# EAGLE board cigpack-main rc1a (EAGLE 4.13)
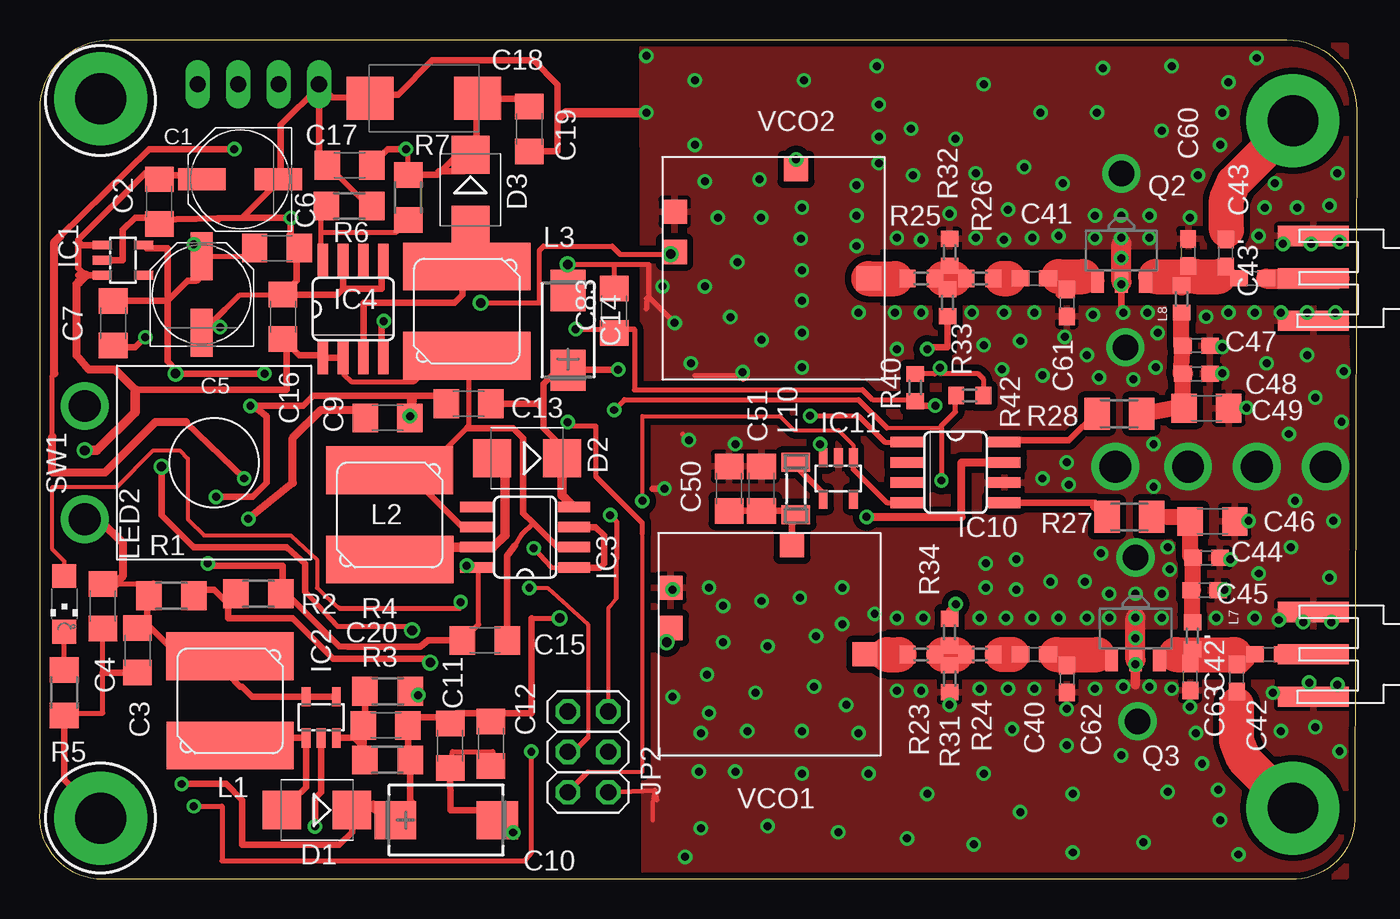
[diagram p1: board, top side]
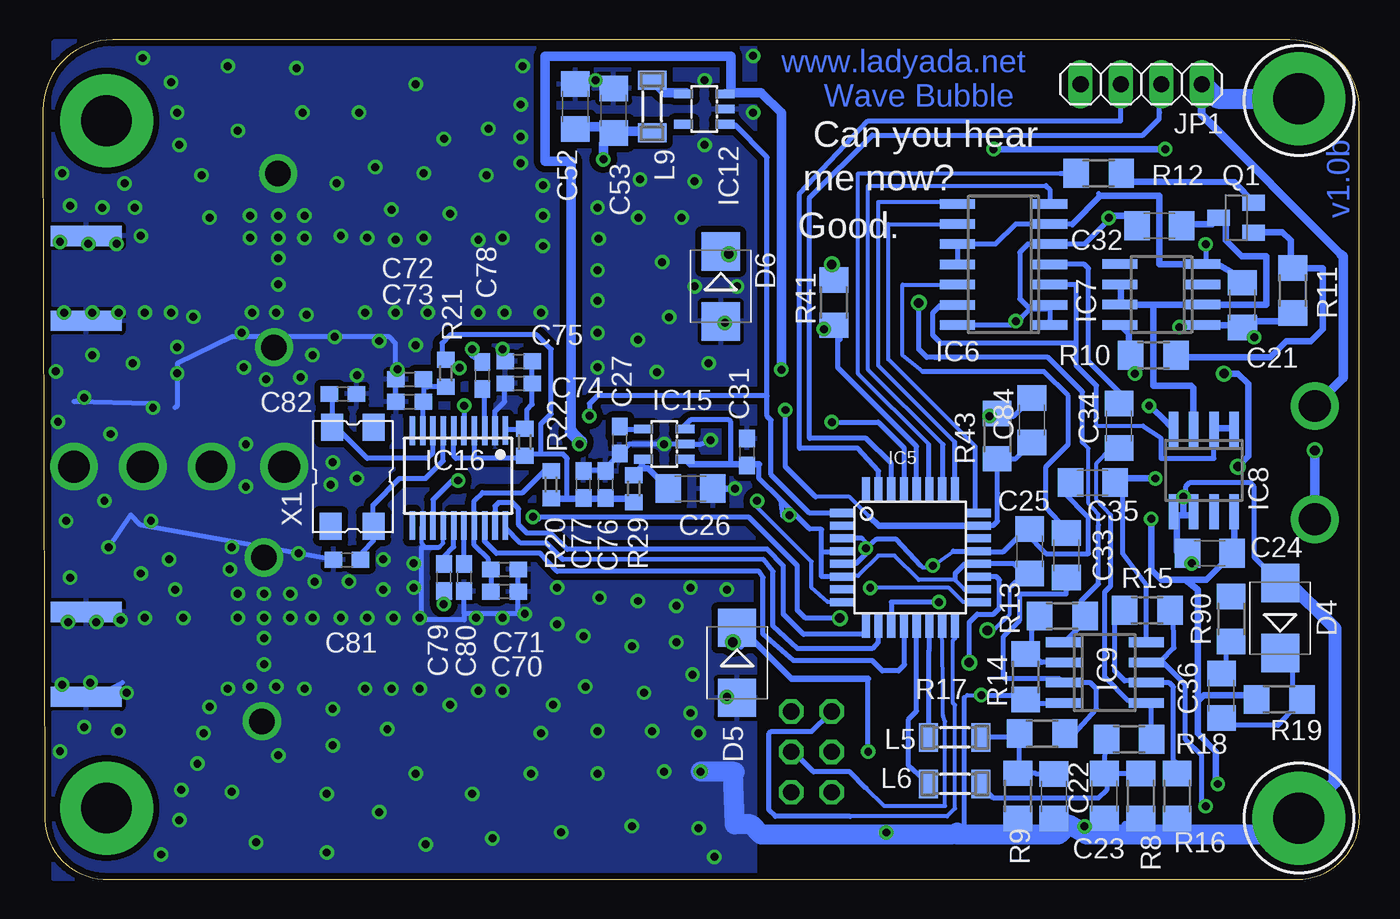
[diagram p2: board, bottom side, seen from below]

Size 82.75 x 52.73 mm. Coordinates in mm from the lower left corner, seen from the top.
Outline: 3.57,0 arc-90 0.02,4.31 0.02,48.34 arc-90 4.4,52.73 78.36,52.73 arc-90 82.75,48.32 82.65,4.08 arc-90 78.96,0 3.57,0
Copper layers (1*16): Top 0.035mm / dielectric 1.5mm / Bottom 0.035mm
Design rules "default": minimum track width 10mil, minimum drill 19mil, track to track 10mil, track to pad 10mil, pad to pad 10mil, via to via 10mil, smd to smd 0mil, copper to edge 10mil, drill to drill 8mil, minimum pad ring 10mil, minimum via ring 8mil, stop-mask expansion 4mil, vias tented up to drill 0mil, thermal gap 10mil

## Footprints (pad centres in the part's own frame; a part is rotated, then mirrored left to right if it is on the bottom)
PANASONIC_D = smd 3 x 1.4: + 2.4,0; - -2.4,0
C1206 = smd 1.6 x 1.8: 1 -1.4,0; 2 1.4,0
CT7343 = smd 2.6 x 2.4: + 3.2,0; - -3.2,0
CT6032 = smd 2.6 x 2.2: + 2.5,0; - -2.5,0
D/7343-31W = smd 2.95 x 2.7: + 3.375,0; - -3.375,0
C0603 = smd 1.1 x 1: 1 -0.85,0; 2 0.85,0
SMB = smd 2.4 x 2.4: A 2.2,0; C -2.2,0
SOT23-5L = smd 0.55 x 1.2: 1 -0.95,-1.3; 2 0,-1.3; 3 0.95,-1.3; 4 0.95,1.3; 5 -0.95,1.3
SO08 = smd 0.66 x 2.032: 1 -1.905,-3.073; 2 -0.635,-3.073; 3 0.635,-3.073; 4 1.905,-3.073; 5 1.905,3.073; 6 0.635,3.073; 7 -0.635,3.073; 8 -1.905,3.073
TQFP32-08 = smd 1.524 x 0.508: 1 -4.293,2.8; 2 -4.293,2; 3 -4.293,1.2; 4 -4.293,0.4; 5 -4.293,-0.4; 6 -4.293,-1.2; 7 -4.293,-2; 8 -4.293,-2.8; 17 4.293,-2.8; 18 4.293,-2; 19 4.293,-1.2; 20 4.293,-0.4; 21 4.293,0.4; 22 4.293,1.2; 23 4.293,2; 24 4.293,2.8 | smd 0.508 x 1.524: 9 -2.8,-4.293; 10 -2,-4.293; 11 -1.2,-4.293; 12 -0.4,-4.293; 13 0.4,-4.293; 14 1.2,-4.293; 15 2,-4.293; 16 2.8,-4.293; 25 2.8,4.293; 26 2,4.293; 27 1.2,4.293; 28 0.4,4.293; 29 -0.4,4.293; 30 -1.2,4.293; 31 -2,4.293; 32 -2.8,4.293
SO14 = smd 0.6 x 2.2: 1 -3.81,-2.9; 2 -2.54,-2.9; 3 -1.27,-2.9; 4 0,-2.9; 5 1.27,-2.9; 6 2.54,-2.9; 7 3.81,-2.9; 8 3.81,2.9; 9 2.54,2.9; 10 1.27,2.9; 11 0,2.9; 12 -1.27,2.9; 13 -2.54,2.9; 14 -3.81,2.9
SO08' = smd 0.6 x 2.2: 1 -1.905,-2.6; 2 -0.635,-2.6; 3 0.635,-2.6; 4 1.905,-2.6; 5 1.905,2.6; 6 0.635,2.6; 7 -0.635,2.6; 8 -1.905,2.6
TSSOP-20 = smd 0.35 x 1.8: 1 -2.835,-3.023; 2 -2.195,-2.999; 3 -1.545,-2.999; 4 -0.895,-2.999; 5 -0.245,-2.999; 6 0.405,-2.999; 7 1.055,-2.999; 8 1.705,-2.999; 9 2.355,-2.999; 10 3.005,-2.999; 11 3.005,2.951; 12 2.355,2.951; 13 1.705,2.951; 14 1.055,2.951; 15 0.405,2.951; 16 -0.245,2.951; 17 -0.895,2.951; 18 -1.545,2.951; 19 -2.195,2.951; 20 -2.845,2.951
1X04 = drill 1.016 long: 1 -3.81,0; 2 -1.27,0; 3 1.27,0; 4 3.81,0
2X03 = drill 1.016 octagon: 1 -2.54,-1.27; 2 -2.54,1.27; 3 0,-1.27; 4 0,1.27; 5 2.54,-1.27; 6 2.54,1.27
CDRH6D28 = smd 3 x 8: L1 -2.8,-0.008; L2 2.8,0.008
SM-1206 = smd 1.2 x 1.8: 1 -1.65,0; 2 1.65,0
0603 = smd 1 x 1.1: 1 -0.875,0.025; 2 0.825,0.025
CHIPLED_1206 = smd 1.5 x 1.5: A 0,-1.75; C 0,1.75
SOT23-BEC = smd 1 x 1.4: B -0.95,-1.1; C 0,1.1; E 0.95,-1.1
SOT89 = smd 0.8 x 1.4: 1 -1.499,-1.981; 2 0,-1.981; 3 1.499,-1.981
R1206 = smd 1.6 x 1.803: 1 -1.422,0; 2 1.422,0
R0603 = smd 1 x 1.1: 1 -0.85,0; 2 0.85,0
M1206 = smd 1.6 x 2: 1 -1.4,0; 2 1.4,0
JUDCOSPST = drill 2 round: P 3.556,-8.128; T -3.556,-8.128
SMA-ANTENNA = smd 1.27 x 4.445: COND 0,-2.794; GND3 -2.667,-2.794; GND4 2.667,-2.794 | smd 1.27 x 4.445 bottom: GND -2.667,-2.794; GND2 2.667,-2.794
MINICIRCUITS_KG = smd 1.524 x 1.524: P$1 3.429,0.762; P$2 5.969,0.762; P$10 7.62,12.954; P$14 0.762,8.382
ABMM = smd 1.7 x 1.4: NC 3.1,-1.3; NC2 -3.1,1.4; X1 -3.1,-1.3; X2 3.1,1.3

## Placement (x,y rotation side)
C1  100uF/6.3  [PANASONIC_D]  12.59,43.97 180 top
C2  .1uF  [C1206]  7.51,42.57 270 top
C3  .1uF  [C1206]  6.14,14.37 270 top
C4  1.0uF  [C1206]  3.97,17.15 270 top
C5  100uF/4V  [PANASONIC_D]  10.18,36.73 90 top
C6  1uF  [C1206]  14.9,39.64 0 top
C7  .1uF  [C1206]  4.61,34.92 270 top
C9  .1uF  [C1206]  21.86,28.98 0 top
C10  100uF/10V  [CT7343]  25.55,3.71 180 top
C11  .1uF  [C1206]  25.79,8.38 270 top
C12  1.0uF  [C1206]  28.35,8.52 270 top
C13  .1uF  [C1206]  26.94,29.87 180 top
C14  68uF/16V  [CT6032]  33.19,34.47 270 top
C15  1.0uF  [C1206]  27.97,15 180 top
C16  .1uF  [C1206]  15.28,35.33 90 top
C17  .1uF  [C1206]  19.47,44.85 180 top
C18  22uF/35V  [D/7343-31W]  24.15,49.05 0 top
C19  1.0uF  [C1206]  30.76,47.13 270 top
C20  160pF  [C1206]  21.75,9.66 180 top
C21  .1uF  [C1206]  7.38,36.07 270 bottom
C22  4.7uF  [C1206]  19.22,5.2 270 bottom
C23  4.7uF  [C1206]  16.05,5.23 270 bottom
C24  .1uF  [C1206]  9.42,20.47 180 bottom
C25  .1uF  [C1206]  20.74,20.59 90 bottom
C26  1.0uF  [C1206]  42.06,24.54 0 bottom
C27  .01uF  [C0603]  46.5,27.58 270 bottom
C31  .1uF  [C0603]  38.5,26.82 90 bottom
C32  .1uF  [C1206]  12.59,41.05 180 bottom
C33  4.7uF  [C1206]  18.43,20.34 270 bottom
C34  4.7uF  [C1206]  15.13,28.47 270 bottom
C35  .1uF  [C1206]  16.78,24.92 180 bottom
C36  .47uF  [C1206]  8.69,11.52 270 bottom
C40  68pF  [C0603]  62.5,14.12 180 top
C41  100pF  [C0603]  62.5,37.74 180 top
C42  68pF  [C0603]  77.23,14.12 180 top
C42'  68pF  [C0603]  75.22,12.65 90 top
C43  100pF  [C0603]  76.22,37.74 180 top
C43'  100pF  [C0603]  74.52,39.33 270 top
C44  1000pF  [C0603]  73.32,20.19 180 top
C45  22pF  [C0603]  73.19,18.16 180 top
C46  .1uF  [C1206]  73.7,22.47 180 top
C47  1000pF  [C0603]  72.68,33.52 180 top
C48  68pF  [C0603]  72.68,31.74 180 top
C49  .1uF  [C1206]  73.32,29.59 180 top
C50  1uF  [C1206]  43.33,24.54 90 top
C51  0.1uF  [C1206]  45.36,24.54 90 top
C52  1uF  [C1206]  49.29,48.54 90 bottom
C53  0.1uF  [C1206]  46.88,48.29 90 bottom
C60  3.9pF  [C0603]  72.16,39.38 90 top
C61  5.6pF  [C0603]  64.54,36.2 270 top
C62  0pF  [C0603]  64.54,12.58 270 top
C63  1.0pF  [C0603]  72.29,12.71 270 top
C70  .01uF  [C0603]  53.74,18.06 0 bottom
C71  100pf  [C0603]  53.74,19.46 0 bottom
C72  100pf  [C0603]  59.71,31.39 180 bottom
C73  .01uF  [C0603]  59.71,30 180 bottom
C74  100pf  [C0603]  52.85,31.14 180 bottom
C75  .01uF  [C0603]  52.85,32.54 180 bottom
C76  .1uF  [C0603]  47.39,24.79 90 bottom
C77  4.7uF  [C0603]  48.79,24.79 90 bottom
C78  100pf  [C0603]  55.14,31.65 270 bottom
C79  100pf  [C0603]  57.55,18.95 90 bottom
C80  100pf  [C0603]  56.28,18.95 270 bottom
C81  20pF  [C0603]  63.64,20.07 180 bottom
C82  20pF  [C0603]  63.89,30.48 0 bottom
C83  0.1uF  [C1206]  36.1,35.7 90 top
C84  0.1uF  [C1206]  20.6,28.84 90 bottom
D1  1N5817  [SMB]  17.42,4.34 180 top
D2  1N5817  [SMB]  30.63,26.44 180 top
D3  1N5817  [SMB]  27.06,43.31 270 top
D4  1N5235  [SMB]  5,16.4 90 bottom
D5  1N5817  [SMB]  39.13,13.59 270 bottom
D6  1N5817  [SMB]  40.15,37.24 270 bottom
IC1  TPS79333  [SOT23-5L]  5.23,38.89 270 top
IC2  LM2733  [SOT23-5L]  17.68,10.17 0 top
IC3  LT1301  [SO08]  30.5,21.49 90 top
IC4  LT1173CS  [SO08]  19.7,35.81 0 top
IC5  ATMEGA48-20A  [TQFP32-08]  28.24,20.21 0 bottom
IC6  AD8402  [SO14]  22.38,38.62 90 bottom
IC7  NE555D  [SO08']  12.46,36.73 90 bottom
IC8  LM358D  [SO08']  9.8,25.68 180 bottom
IC9  LM358D  [SO08']  16.02,12.98 270 bottom
IC10  MIC2506BM  [SO08]  57.55,25.55 270 top
IC11  MIC2514  [SOT23-5L]  50.18,25.17 180 top
IC12  MIC2514  [SOT23-5L]  41.19,48.38 90 bottom
IC15  LP2985  [SOT23-5L]  43.71,27.33 90 bottom
IC16  LMX243X  [TSSOP-20]  56.53,25.17 180 bottom
JP1  [1X04]  13.73,49.94 180 bottom
JP2  [2X03]  34.46,8 270 top
L1  15uH  [CDRH6D28]  11.96,11.2 270 top
L2  33uH  [CDRH6D28]  21.99,22.88 270 top
L3  33uH  [CDRH6D28]  26.84,35.68 90 top
L5  1K  [SM-1206]  25.44,8.91 0 bottom
L6  1K  [SM-1206]  25.44,5.99 0 bottom
L7  22nH  [0603]  72.41,15.27 270 top
L8  33nH  [0603]  71.77,36.47 90 top
L9  0  [SM-1206]  44.47,48.54 90 bottom
L10  0  [SM-1206]  47.52,24.54 270 top
LED2  [CHIPLED_1206]  1.54,17.3 180 top
Q1  3906  [SOT23-BEC]  7.77,41.55 90 bottom
Q2  SXA-389B  [SOT89]  67.97,39.51 0 top
Q3  SXA-389B  [SOT89]  68.86,15.76 0 top
R1  510K  [R1206]  8.27,17.8 180 top
R2  220K  [R1206]  13.73,17.93 180 top
R3  37K  [R1206]  21.86,7.49 0 top
R4  12K  [R1206]  21.86,11.81 180 top
R5  2K  [R1206]  1.54,11.71 270 top
R6  50K  [R1206]  19.44,42.29 180 top
R7  1M  [R1206]  23.16,42.82 90 top
R8  (adj)  [R1206]  13.76,5.23 270 bottom
R9  (adj)  [R1206]  21.48,5.23 270 bottom
R10  10K  [R1206]  12.97,32.92 180 bottom
R11  20K  [R1206]  4.21,36.98 90 bottom
R12  100  [R1206]  16.4,44.35 180 bottom
R13  100K  [R1206]  18.69,16.54 0 bottom
R14  10K  [R1206]  21,12.72 90 bottom
R15  100K  [R1206]  13.35,16.89 0 bottom
R16  10K  [R1206]  11.47,5.23 90 bottom
R17  10K  [R1206]  19.95,9.14 0 bottom
R18  10K  [R1206]  14.5,8.79 0 bottom
R19  2K  [R1206]  5.06,11.29 0 bottom
R20  18  [R0603]  50.82,24.79 90 bottom
R21  18  [R0603]  57.42,31.77 90 bottom
R22  18  [R0603]  52.47,27.46 270 bottom
R23  18  [R0603]  55.39,14.12 180 top
R24  18  [R0603]  59.07,14.12 180 top
R25  18  [R0603]  55.39,37.74 180 top
R26  18  [R0603]  59.07,37.74 180 top
R27  0  [M1206]  68.47,22.76 180 top
R28  0  [M1206]  67.84,29.23 180 top
R29  18  [R0603]  45.61,24.54 270 bottom
R31  0  [R0603]  57.18,12.58 270 top
R32  68  [R0603]  57.18,39.38 90 top
R33  50  [R0603]  57.04,36.22 270 top
R34  50  [R0603]  57.17,15.52 90 top
R40  10k  [R0603]  55.01,30.89 270 top
R41  10k  [R1206]  33.04,36.22 90 bottom
R42  10k  [R0603]  58.44,30.38 180 top
R43  10k  [R1206]  22.78,27.83 270 bottom
R90  100K  [R1206]  8.08,16.34 270 bottom
SW1  SPST  [JUDCOSPST]  10.95,26.17 270 top
U$8  SMAANTENNA  [SMA-ANTENNA]  82.82,37.74 270 top
U$9  SMAANTENNA  [SMA-ANTENNA]  82.82,14.12 270 top
VCO1  ROS2500  [MINICIRCUITS_KG]  38.88,21.74 270 top
VCO2  ROS1200  [MINICIRCUITS_KG]  39.13,45.36 270 top
X1  10.000 MHz  [ABMM]  63.27,25.28 90 bottom

## Tracks (layer width: path | path; a pad name or v marks a point on that pad's centre or on a via)
+6V  (via drill 0.5, 0.6)
  Top 0.305: 30.89,16.39 v32.67,16.39 | 28.86,10.42 28.73,10.04 28.61,10.17 C12.1 | 25.43,10.17 25.56,10.04 25.66,10.17 C11.1 | 23.08,10.23 23.02,10.3 C20.1
  Top 0.406: 30.89,16.39 30.89,10.42 28.86,10.42 26.19,10.42 | 26.19,10.42 25.43,10.17 23.27,10.17 23.08,10.23 23.02,10.17 | 25.92,9.9 25.81,9.92 26.19,10.42 | C20.1 23.15,8.13 23.27,8.01 23.28,8.02 R3.2 23.28,4.97 23.27,4.96 23.36,4.87 C10.+ 20.24,4.72 20.98,4.71 20.97,4.72 D1.C 19.62,2.96 18.82,2.17 12.73,2.17 12.73,4.96 11.71,5.98 v8.92,5.98 | C9.1 20.48,28.97 | C9.1 | 19.7,29.49 19.95,29.49 C9.1
  Top 0.508: v13.1,22.63 15.9,24.9 15.9,27.72 17.67,29.49 19.7,29.49 | IC10.7 57.93,26.19 57.93,22.76 v51.96,22.76
  Top 0.61: C9.1 | C9.1 20.97,28.47 | C9.1 20.21,29.23
  Bottom 0.305: 51.58,22.63 51.83,22.63 51.95,22.74 | 51.95,22.74 v51.96,22.76 | 51.95,22.74 38.38,22.74 35.33,19.69 35.33,16.9 34.83,16.39 v32.67,16.39
  Bottom 0.406: v51.96,22.76 51.96,22.5 | 9.81,11.57 7.1,11.57 R19.1 6.61,11.67 6.63,11.69 6.89,11.44 | 9.81,11.57 10.19,11.31 10.19,18.17 10.95,18.81 | 10.95,18.81 12.47,18.81 13.11,19.44 13.11,21.37 v13.1,22.63 | 8.02,20.44 7.89,20.32 | 8.02,20.44 C24.1 | 7.89,20.32 IC8.8 | 7.89,20.32 7.78,20.2 | 8.02,20.44 9.65,18.81 10.95,18.81 | v8.92,5.98 9.05,5.98 9.05,8.01 10.19,9.15 10.19,11.19 9.81,11.57
+12V  (via drill 0.5)
  Top 0.305: IC11.3 49.17,26.4 v49.04,27.33
  Top 0.406: 32.95,26.57 D2.C 32.83,27.16 31.65,28.33 31.65,29.47 | 28.85,30.25 28.72,30.12 28.47,30.12 | 28.47,30.12 28.34,30.12 | 28.47,30.12 28.47,30.25 | C13.1 28.47,29.99 28.47,30.12 | 28.34,29.98 28.35,29.98 | C13.1 28.34,29.98 | 28.34,29.98 28.22,29.98 | v36.35,32.01 34.57,32.01 32.67,31.99 32.56,31.89 | C13.1 28.45,29.98 | 32.56,31.89 32.41,31.89 31.65,31.12 31.65,29.47 | C14.+ 33.11,31.89 32.56,31.89 | C13.1 28.35,29.86 28.35,29.85 31.27,29.85 31.65,29.47
  Top 0.61: IC3.4 33.55,23.39 32.83,24.11 D2.C
  Bottom 0.61: 49.56,28.08 49.56,45.09 51.21,45.09 51.21,51.7 39.53,51.7 39.53,49.33 IC12.3 39.73,49.33 39.65,49.41 37.62,49.41 36.35,48.14 v36.35,32.01
  Bottom 0.813: 49.56,28.08 48.94,27.46 v49.04,27.33
+24V  (via drill 0.5)
  Top 0.305: C17.1 21.5,45.47 21.63,45.6 | v23.02,45.86 23.12,45.6 R7.2 | 0.92,31.76 0.79,31.63 0.79,27.82
  Top 0.406: v12.85,25.17 9.18,28.71 | 1.29,40.39 6.89,45.86 v12.22,45.86 | R7.2 25.01,44.24 25.14,44.37 | C17.1 20.87,44.95 | 21.5,45.47 21.49,45.48 21.87,45.86 v23.02,45.86 | 21.5,45.47 | 25.14,44.37 27.46,46.69 27.46,48.98 C18.+ 27.51,49.03 | 27.51,49.03 27.33,49.03 | C19.1 30.26,49.03 27.51,49.03 | 25.14,44.37 25.05,44.46 26.65,44.46 D3.C
  Top 0.508: 1.29,40.39 0.92,40.01 0.92,31.76 | 0.79,27.82 0.79,25.54 4.09,25.54 7.27,28.71 9.18,28.71
  Bottom 0.305: IC9.8 13.42,18.48 14.89,20.46 14.89,25.17 15.4,24.9 15.63,24.66 C35.1
  Bottom 0.406: 14.89,25.17 v12.85,25.17 | v12.22,45.86 v23.02,45.86
CLK
  Bottom 0.254: 24.16,27.19 29.62,32.65 29.62,41.16 IC6.9
  Bottom 0.305: IC5.24 24.16,23.21 24.16,27.19
CP_IF  (via drill 0.5)
  Top 0.305: R40.2 55.01,30.12 52.34,30.12 51.71,30.76 37.37,30.74 37.37,34.55 | v33.68,34.55 37.37,34.55 | 37.37,34.55 36.1,34.55 C83.1
  Top 0.406: 55.01,30.12 55.39,29.74 v56.28,29.74
  Bottom 0.305: IC16.5 v56.29,29.73 v56.28,29.74 | IC5.28 27.84,27.19 32.79,32.14 32.79,34.43 32.66,33.91 R41.1 32.67,34.43 32.67,34.55 v33.68,34.55
CP_RF  (via drill 0.5)
  Top 0.254: 53.23,28.35 56.66,28.35
  Top 0.305: v56.66,25.04 56.66,28.35 56.66,28.47 57.55,29.36 57.55,30.38 | 57.55,30.38 57.42,30.38 | 53.23,28.35 51.45,30.12 36.75,30.12 v36.1,29.47 | 57.55,30.38 R42.2
  Bottom 0.254: 30.79,22.74 32.06,24.01 34.19,24.01
  Bottom 0.305: IC16.13 58.24,23.85 57.04,25.04 v56.66,25.04 | IC5.23 23.05,22.2 22.76,22.49 22.76,24.27 22.78,25.01 R43.2 22.76,26.43 21.62,26.43 C84.1 | 34.19,24.01 36.1,25.92 v36.1,29.47
  Bottom 0.406: IC5.23 30.22,22.2 30.79,22.74
FB
  Top 0.305: IC4.8 17.68,39 17.68,40.65 | R6.2 17.68,42.2 17.68,40.65 | R7.1 22.41,40.65 17.68,40.65
GND  (via drill 0.5, 0.6, 1.6, 2, 3.2 pad 5.84)
  Top 0.254: IC3.8 26.69,19.71 | 38.64,5.6 38.51,4.84 38.51,3.69
  Top 0.305: 38.27,36.58 v39.9,34.95 40.15,34.95 | IC3.8 26.69,19.58 | VCO2.P$1 39.77,41.81 | 33.57,22.22 33.67,22.12 | 33.57,22.22 IC3.3 33.59,22.11 | 33.57,22.22 33.55,22.25 | 39.64,17.93 VCO1.P$1 v39.77,18.19 | 44.21,31.39 44.47,31.65 41.17,31.65 | U$8.GND4 79.39,35.08 | v40.79,27.58 40.4,27.96 | 38.12,35.81 38.12,36.47 38.25,36.6 | 20.98,42.43 | 20.98,42.43 R6.1 | C17.2 20.5,42.43 20.98,42.43 | C16.2 15.3,36.71 15.4,36.71 12.56,36.71 11.59,35.73 | IC3.8 26.97,19.58 26.95,19.57 v26.83,19.69 | C9.2 23.27,28.97 23.14,28.84 v23.27,29.09 | IC3.1 32.16,19.57 v31.04,20.79 | 21.49,34.93 21.62,34.81 v21.62,35.06 | 38.76,4.96 38.64,5.6 35.74,5.47 JP2.6 | 38.25,36.6 38.26,36.59 | v33.18,38.62 36.1,38.62 | 36.1,38.62 38.26,38.62 38.25,36.6 | C11.2 25.93,8.01 28.47,8.01 C12.2 | C4.2 3.97,12.96 3.97,10.42 1.55,10.42 1.55,10.3 R5.2 | IC3.8 27.44,19.57 27.59,19.57 27.59,16.01 C15.2 | 36.1,38.62 C83.2
  Top 0.406: 27.55,19.46 IC3.8 27.45,19.56 27.45,19.46 | 33.67,22.12 33.8,22 | 39.64,42.06 39.77,42.06 VCO2.P$1 | IC1.2 5.23,38.89 5.23,40.79 5.99,41.55 6.75,41.55 7.26,41.43 | 7.26,41.43 7.32,41.49 | 7.32,41.49 7.38,41.42 | 11.2,41.52 7.26,41.43 | 12.72,41.55 11.2,41.52 | 12.72,41.55 15.39,44.22 C1.- 15.1,44.08 15.14,44.08 15.14,47.38 17.55,49.79 | v39.26,24.54 38.5,24.54 | 7.32,41.49 7.38,41.55 7.38,41.68 C2.2 | 23.26,30.38 C9.2 | 23.26,30.38 25.55,30.38 C13.2 25.68,29.73 25.68,29.6 | 23.4,30.36 17.17,30.36 16.54,29.73 v13.24,29.73 13.3,29.79 14.25,29.09 14.25,24.9 13.36,24.01 v11.08,24.01 | 23.4,30.36 23.65,30.36 | 23.26,30.38 23.37,30.24 23.4,30.36 | 11.2,41.52 11.2,41.41 | 11.59,35.73 C5.- 9.81,34.33 10.16,34.68 v11.33,34.68 | 12.72,41.55 12.73,41.54 v15.78,41.54 15.78,40.17 C6.2 16.19,39.76 16.16,39.76 16.16,37.6 C16.2 15.27,36.71 | IC4.4 21.49,32.85 21.49,34.93 21.75,35.19 | IC4.7 19.08,38.87 19.08,37.09 | 19.08,37.09 21.49,37.09 21.49,39 | 21.49,39 | 21.49,39 IC4.5 | 15.27,36.71 15.14,36.71 | 19.08,37.09 18.7,36.71 15.4,36.71 15.27,36.71 | 17.55,49.79 17.55,49.93 JP1.4 18.36,49.11 C18.- 20.6,49.22 20.6,49.29 22.51,49.29 24.67,51.44 31.02,51.44 32.54,49.92 32.54,47.63 | C17.2 17.55,45.37 17.55,49.79 | v10.56,19.84 10.56,19.69 15.26,19.69 15.26,17.75 15.39,17.55 15.64,17.55 15.16,17.53 R2.1 15.4,17.41 15.91,17.54 18.82,14.62 19.33,14.61 23.9,14.61 24.41,15 C15.2 | v68.09,35.58 67.96,35.83 67.97,35.82 Q2.2 | v3.84,3.82 3.84,3.95 1.54,6.24 R5.2 | v17.3,3.31 17.3,5.09 17.68,5.47 IC2.2 | R4.1 23.66,11.81 v23.78,11.57 | v29.75,2.93 29.76,2.95 C10.- 28.49,4.34 28.73,4.33 25.82,4.31 C11.2
  Top 0.406: C7.2 4.72,33.41 6,33.41 v6.63,34.05 | C19.2 32.54,45.73 32.54,47.63 | C14.- 32.95,37.22 32.79,37.22 33.05,37.47 33.05,38.62 v33.18,38.62 | IC3.3 34.94,22.12 35.46,21.6 35.46,19.82 35.21,19.57 33.56,19.57 IC3.1 | IC3.1 | 32.54,47.63 33.06,48.16 | C3.2 3.97,12.96
  Top 0.61: 23.39,30.12 C9.2 | 68.86,12.2 Q3.2 | 33.06,48.16 v38.12,48.16
  Top 1.27: Q3.2 68.86,16.39 | Q2.2 67.97,39.89
  Bottom 0.254: IC16.14 57.59,21.11 57.84,20.85 58.69,20.85 58.95,21.11 58.95,22.16 IC16.12 58.89,22.25 | v26.83,19.69 25.53,20.6 | 27.59,19.69 27.46,19.57 26.95,19.57 | 31.27,21.4 31.02,21.15 v31.04,20.79 | 25.17,3.18 24.84,3.29 | 24.84,11.41 24.67,11.57 v23.78,11.57
  Bottom 0.305: D6.A 40.15,34.95 v39.9,34.95 | U$8.GND4 80.54,35.2 v78,35.58 | v78.12,39.9 U$8.GND | U$9.GND4 79.65,11.45 79.77,11.33 77.74,12.34 | 60.6,30 C73.2 60.69,30.12 | C72.2 60.6,31.35 60.6,30 | C71.2 52.89,18.1 52.85,18.06 C70.2 52.89,16.66 52.6,16.66 | v80.16,30.25 80.79,30 75.97,29.87 | v78.63,20.85 77.23,22.88 76.6,22.25 C81.2 | 60.6,30 60.6,33.68 60.98,34.06 70.88,34.06 74.31,32.41 74.31,29.74 74.44,29.62 | 52.22,16.66 v52.47,16.66 52.6,16.66 | 56.28,16.66 C80.2 | 52.6,16.66 56.28,16.66 | 57.84,20.85 58.95,20.85 58.95,16.28 56.28,16.28 56.28,16.66 | 47.43,25.68 C76.2 | C77.2 48.75,25.68 47.43,25.68 | v40.79,27.58 41.42,27.33 IC15.2 45.9,27.33 C27.2 46.5,26.69 47.43,25.77 47.43,25.68 | IC16.2 54.34,29.4 53.74,30 53.74,31.14 C74.2 | C75.2 53.7,32.62 53.87,32.79 v53.87,33.3 | 18.72,34.91 18.82,34.81 IC6.1 19.46,34.81 19.33,34.93 19.48,35.08 19.48,35.97 19.59,36.08 IC6.2 19.46,36.08 19.71,35.82 20.73,35.82 | 19.46,39.89 17.3,39.89 15.52,41.67 | IC9.4 18.64,11.06 20.51,11.06 R14.1 21.52,11.57 v23.78,11.57 23.65,11.69 | C24.2 10.7,20.58 10.57,20.58 | 11.33,3.69 11.35,3.68 R16.1 | 11.33,3.69 11.44,3.8 | C23.2 16.79,3.83 16.79,3.82 16.78,3.8 | C23.2 16.55,3.83 16.54,3.82 16.56,3.8 | 18.32,3.44 18.32,3.69 18.18,3.83 | 20.73,35.82 21.36,36.46 21.36,39.38 20.86,39.89 19.46,39.89 | 19.46,39.89 IC6.5 | 20.98,21.73 21.24,21.73 22.38,20.58 23.97,20.58 | 20.98,21.73 20.76,21.73 C25.2 21,21.74 20.98,21.73 | 23.97,20.58 24.16,20.58 | 23.97,20.58 IC5.21 25.53,20.6 | C35.2 18.56,24.26 17.05,22.74 17.05,20.46 19.71,20.46 20.98,21.73 | v23.27,29.09 22.67,29.13 R43.1 22.76,29.24 22.76,29.09 21.75,29.09 C84.2
  Bottom 0.305: 31.27,21.4 IC5.3 | IC5.5 32.29,19.82 31.65,19.82 31.02,20.46 v31.04,20.79 30.38,21.35 29.11,21.35 27.59,19.69 | 26.83,19.57 v26.83,19.69 26.95,19.57 | 20.73,35.82 21.75,34.81 | 21.75,34.81 IC6.14 | 21.75,34.81 21.62,34.93 v21.62,35.06 | 38.26,3.44 38.39,3.58 | 11.33,3.69 11.2,3.57 11.2,2.8 | 15.27,2.8 15.27,3.06 15.28,3.06 | 15.28,3.06 C23.2 | 14.89,3.18 14.89,3.06 15.28,3.06 | 18.44,3.31 18.57,3.44 18.85,3.44 C22.2 | 21.75,2.68 21.75,2.8 21.75,3.55 R9.2 | 24.84,3.29 24.84,11.41 | R41.2 32.96,37.26 v33.18,38.62 | D4.A 6.63,20.24 6.63,24.65 6.89,24.9 10.7,24.9 10.95,24.65 10.95,24.01 v11.08,24.01
  Bottom 0.406: C26.2 v39.26,24.54 | 17.93,50.44 17.8,50.44 JP1.4 | 9.88,34.81 9.93,34.81 | 9.88,34.81 IC7.1 9.85,34.81 9.55,34.81 | 9.55,34.81 8.41,34.81 | 6.76,35.06 C21.2 7.24,34.81 | R11.1 4.47,35.06 6.76,35.06 | 6.76,35.06 6.89,35.06 6.63,35.32 v6.63,34.05 | C32.2 14.61,41.67 15.52,41.67 15.65,41.67 v15.78,41.54 | 7.24,34.81 7.14,34.81 | 7.24,34.81 9.55,34.81 | 9.55,34.81 9.88,34.81 | IC8.6 10.57,22.94 10.57,22.87 11.08,22.87 | 11.49,22.87 IC8.5 11.59,22.96 | 11.08,22.87 11.49,22.87 | IC8.4 12.47,29.05 v13.24,29.73 | 11.33,20.84 11.33,20.71 | 11.33,20.84 11.33,20.99 | C24.2 10.57,20.22 | 4.09,4.2 3.84,3.95 v3.84,3.82 | 25.3,2.8 25.17,3.18 | 25.3,2.93 24.92,2.93 | 24.92,2.93 25.17,2.93 | 25.17,3.18 24.92,2.93 | 25.17,3.18 24.79,2.8 25.68,2.8 | v11.33,34.68 11.2,34.81 9.55,34.81 | C24.2 10.82,20.58 11.49,20.58 | 11.49,22.87 11.49,20.58 | 11.33,20.84 11.2,20.84 | 11.49,20.58 11.49,20.84 11.33,20.84 | C24.2 10.82,20.33 10.56,20.33 v10.56,19.84 | v11.08,24.01 11.08,22.87 | 14.76,3.31 14.63,3.18 | 14.89,3.18 14.76,3.31 | 14.76,3.31 14.76,3.44 | R8.2 14.27,3.8 14.76,3.31 | 18.44,3.31 v17.3,3.31 | 29.62,2.8 v29.75,2.93
  Bottom 0.508: 17.8,50.44 17.8,50.57
  Bottom 0.813: 3.97,3.57 3.84,3.69 v3.84,3.82 1.54,6.12 1.54,15.75 4.6,18.81 4.6,18.93 4.93,18.6 D4.A
  Bottom 1.27: v3.84,3.82 5.11,3.44 5.74,2.8 11.2,2.8 15.27,2.8 17.17,2.8 18.32,3.44 18.44,3.31 18.95,2.8 21.75,2.8 24.79,2.8 25.3,2.8 25.3,2.93 25.68,2.8 29.62,2.8 37.62,2.8 38.26,3.44 39.27,3.44 39.4,6.74 39.28,6.74 v41.42,6.76
  other vias: 78.89,23.77 41.55,9.17 39.77,11.46 42.06,10.44 41.93,12.85 44.47,9.3 47.9,9.3 48.66,12.09 50.69,10.95 50.44,16.03 50.44,18.31 48.79,15.27 45.74,14.63 44.98,11.71 42.94,14.88 42.94,17.17 45.36,17.47 47.77,17.68 40.56,1.4 42.06,18.31 64.53,8.41 81.81,28.73 70.12,32.16 54.76,47.14 78,9.3 80.16,9.55 60.72,16.41 81.04,18.95 81.3,22.5 62.38,16.41 78.5,27.96 51.45,9.17 47.9,32.16 47.9,36.35 47.82,40.23 45.36,33.88 39.13,37.24 43.83,38.76 45.33,41.55 41.8,37.24 45.23,43.97 47.9,38.25 43.4,35.31 42.61,41.55 47.9,34.32 41.8,43.84 47.9,42.19 40.91,32.41 69.74,41.68 76.98,42.19 79.65,32.92 66.82,50.95 51.33,39.78 51.45,35.59 51.33,41.68 52.6,51.08 74.69,50.06 74.31,48.16 74.19,46.13 72.79,44.22 81.04,42.32 71.14,51.08 44.16,31.85 41.55,3.2 43.71,6.76 51.33,43.59 48.02,50.19 70,24.66 64.41,34.06 59.33,33.55 81.55,44.35 54.88,44.22 60.85,42.06 58.82,44.35 57.55,46.51 62.88,48.16 61.87,44.73 66.44,48.16 47.9,6.63 45.74,3.33 50.18,2.95 52.09,6.63 54.5,2.56 59.33,6.63 75.33,1.55 70.88,5.49 64.92,1.68 81.68,8.03 64.92,5.36 61.11,9.42 61.61,4.22 55.77,5.36 58.69,2.18 76.47,51.59 76.6,40.41 77.62,43.71 64.28,43.71 79.9,39.9 79.65,35.59 81.43,35.59 81.68,40.03 65.8,32.92 74.31,33.43 61.61,33.81 60.47,32.03 65.8,16.41 66.69,20.47 64.03,16.41 59.07,16.41 43.71,27.33 79.39,16.15 81.17,16.15 76.6,19.2 64.53,26.19 79.77,12.34 81.55,12.22 57.17,41.81 53.87,40.28 55.39,40.16 58.82,40.28 60.6,40.16 62.38,40.28 58.57,35.59 53.74,35.59 55.39,35.59 60.6,35.59 62.5,35.59 64.03,40.41 66.31,40.28 67.96,40.28 69.74,40.28 67.96,37.36 67.96,39.01 72.28,41.55 79.01,42.19 68.73,31.39 66.19,35.46 69.61,35.59 70.25,34.32 74.69,35.59 76.35,35.59 77.11,32.41 74.31,31.77 75.84,29.62 66.57,31.52 67.96,41.68 66.31,41.68 74.44,18.19 74.82,20.09 75.96,22.5 67.2,16.41 68.85,17.93 68.85,16.41 70.5,16.41 73.93,16.41 76.35,16.41 77.87,16.28 60.85,11.96 62.5,11.96 66.31,11.96 64.53,10.69 59.07,11.96 68.09,12.09 69.74,12.09 71.14,11.96 57.17,10.95 55.39,11.84 53.87,11.84 53.87,16.41 55.52,16.41 72.28,10.82 77.49,11.71 72.66,9.17 73.04,7.26 74.06,5.61 74.19,3.71 67.96,7.77 69.36,2.31 80.8,25.92 76.48,25.92 72.16,25.92 67.59,25.92 59.45,18.31 59.45,19.84 70,27.33 61.36,20.09 61.36,18.19 65.68,18.69 70.88,20.85 71.01,19.46 81.93,31.9 52.72,44.98 52.72,46.63 52.72,48.67 38.12,51.71 41.17,50.19 67.2,17.93 70.5,17.93 68.85,15.14 68.85,13.49 68.86,20.2 68.99,9.92 68.23,33.41 67.97,44.33 70.5,47.02 59.33,49.94 41.17,46.13 73.3,35.33 63.01,25.17 63.01,31.65 63.52,18.69 64.66,24.79
  pour Top (isolate 0.406): 37.86,52.48 82.06,52.35 82.06,39.76 52.61,39.76 52.61,35.82 82.07,35.82 82.45,15.88 52.99,15.88 52.99,12.33 82.06,12.33 82.06,0.15 37.99,0.28
  pour Bottom (isolate 0.406): 37.99,0.28 37.99,52.73 82.06,52.6 82.06,0.03
LBI  (via drill 0.6)
  Top 0.406: 11.83,17.3 11.93,17.19 R2.2 11.85,17.68 | 11.83,17.3 11.83,16.53 11.84,16.39 15.9,16.39 18.44,13.85 24.29,13.85 v24.54,13.6 | R1.1 9.71,18.17 10.96,18.17 11.83,17.3
  Bottom 0.305: v24.54,13.6 24.54,16.14 24.03,16.65 23.02,16.65 22.63,17.03 22.63,18.81 22.83,19 IC5.19
MISO
  Bottom 0.254: 25.43,15.88 25.43,15.12 25.56,15 25.56,11.06 25.43,10.93 25.43,4.45 25.94,3.95 32.03,3.95
  Bottom 0.305: 33.07,10.17 33.07,10.55 33.05,10.55 33.06,10.54 JP2.1 33.18,10.52 33.18,10.42 33.3,10.42 34.45,9.28 36.99,9.28 37.11,9.15 37.11,4.33 36.73,3.95 32.03,3.95 | IC5.16 25.43,15.9 25.43,15.88
N$1
  Bottom 0.254: 19.71,43.57 30.89,43.57 30.89,32.01 26.19,27.31
  Bottom 0.305: IC6.7 19.48,43.34 19.71,43.57 | IC5.26 26.22,24.52 26.19,24.52 26.19,27.31
N$2
  Top 0.406: 11.83,7.14 11.71,7.26 L1.L2 11.58,7.26 12.91,8.59 | 12.91,8.59 13.1,8.79 | 12.91,8.59 12.86,8.65 13.08,8.87 IC2.1 16.73,6.42 16.74,5.78 D1.A | 12.91,8.59
N$3  (via drill 0.5)
  Top 0.254: 1.54,19.83 LED2.A 1.54,19.07 1.43,19.19 1.55,19.95 0.79,20.71 0.79,24.65 4.85,24.65 7.14,26.93 8.79,26.93 9.3,26.43 9.3,22.62 10.32,21.6 15.78,21.6 17.43,20.08 17.43,18.3 17.94,17.79 18.82,17.03
  Top 0.305: v26.44,17.41 26.44,17.03 18.82,17.03
  Bottom 0.305: IC5.11 29.44,17.41 v26.44,17.41
N$5
  Bottom 0.305: D4.C 4.22,13.43 4.22,11.69 4.09,11.57 4.09,11.49 R19.2 5.14,9.66 8.63,9.66 | 8.63,9.66 8.92,9.92 | 8.63,9.66 C36.2
N$6  (via drill 0.5)
  Top 0.406: v55.77,33.3 55.91,33.41 57.04,33.41 R33.2
  Bottom 0.305: C78.1 55.35,32.5 55.77,32.92
  Bottom 0.406: v55.77,33.3 55.77,32.92 55.64,33.04
N$7
  Bottom 0.305: 27.07,8.78 27.21,8.9 | 27.07,8.78 L5.1 27.08,8.9 27.21,9.15 27.08,9.41 27.08,14.32 27.04,14.36 IC5.14 | 26.7,9.53 27.04,9.57 27.07,8.78
N$8  (via drill 0.5)
  Top 0.305: v48.41,29.11 51.45,29.11 53.1,27.46 IC10.1
  Bottom 0.305: v48.41,29.11 48.41,29.87 47.91,30.36 37.24,30.36 | 37.24,30.36 37.24,45.35 39.27,47.38 39.94,47.38 | 37.24,30.36 37.24,29.09 36.99,28.84 36.99,25.41 34.57,23 32.53,23 | 32.53,23 32.29,23 | IC5.1 32.53,23 | 39.94,47.38 40.16,47.38 | 39.94,47.38 IC12.1
N$9
  Bottom 0.305: L6.1 28.35,7.12 28.35,10.04 27.84,10.55 IC5.13
N$10
  Top 0.61: L2.L2 21.74,19.72 21.86,19.84 24.53,19.84 25.42,20.85 IC3.7 28.35,20.84 28.45,20.84 29.23,21.61 29.23,25.64 D2.A
N$11
  Bottom 0.406: Q1.B 6.38,40.32 6.05,40.65 4.85,40.65 4.35,40.14 4.35,38.36 4.42,38.36 | R10.1 11.92,32.78 5.62,32.78 4.6,33.79 3.08,33.79 2.31,34.55 2.31,38.36 4.42,38.36 | 4.42,38.36 R11.2
N$12
  Bottom 0.406: C32.1 11.2,41.06 11.2,41.16 9.26,41.16 Q1.C 8.75,41.67 8.41,41.67 8.41,40.14 7.39,39.13 5.87,39.13 5.87,36.08 12.47,36.08 | IC7.2 9.88,36.08 12.47,36.08 | 12.98,36.08 12.47,36.08 | 12.98,36.08 15.05,36.08 IC7.7 15.01,36.14 15.01,37.31 IC7.6 | 12.98,36.08 12.98,31 10.57,31 10.44,30.87 10.44,28.29 IC8.3
N$13
  Bottom 0.406: Q1.E 7.85,43.77 12.47,43.82 14.25,43.82 14.78,44.35 R12.1
N$14
  Top 0.305: C41.1 64.37,37.98 64.04,37.86
  Top 0.406: 66.65,37.65 66.7,37.6 | 66.65,37.65 Q2.1 | 65.56,37.86 66.45,37.86 66.65,37.65 | C61.1 64.42,36.71 64.04,36.71 64.04,37.86 C61.1
  Top 2.184: 64.04,37.86 65.56,37.86
N$15
  Bottom 0.254: 16.54,28.97 16.54,28.46 13.62,28.46
  Bottom 0.305: IC6.3 17.81,37.35 17.81,33.66 | IC8.2 9.16,26.43 12.47,26.43 12.47,27.7 13.62,28.46 | IC6.13 26.32,36.08 26.83,35.57 26.83,34.17 26.32,33.66 17.81,33.66 | 17.81,33.66 17.81,32.27 16.54,31 16.54,28.97
  Bottom 0.406: IC8.1 7.9,28.29 7.9,28.33 9.11,28.33 IC8.2
N$16
  Bottom 0.305: R17.2 17.95,9.14 16.54,10.68 16.54,11.95 16.92,12.33 18.57,12.33 18.59,12.34 IC9.3 18.86,12.58 22.25,12.58 22.38,12.71 22.38,15.25 21.36,16.27 21.36,17.92 18.44,17.92 18.43,18.18 C33.2
N$17
  Top 0.406: C40.1 63.35,14.11 63.91,14.11 | 66.45,14.11 64.8,13.98 64.54,13.98 C62.1
  Top 0.61: Q3.1 66.65,13.9 66.45,14.11
  Top 2.184: 63.91,14.11 66.45,14.11
N$18
  Bottom 0.305: 21.24,14.74 21.27,14.78 R14.2 | R14.2 21.33,14.78 20.86,14.23 19.98,13.61 IC9.2 | R14.2 20.62,14.09 20.62,15.62 R13.1
N$19
  Top 0.406: IC4.3 20.35,32.76 20.35,36.2 26.06,36.2 26.57,36.71 26.57,38.62 26.69,38.62 L3.L2
  Top 0.61: L3.L2 26.71,38.36 26.44,38.36 26.44,40.49 D3.A
N$20  (via drill 0.5)
  Top 0.254: v30.76,18.3 31.91,18.3 34.45,16.01 34.45,8.9
  Top 0.305: JP2.3 33.2,8.01 33.56,8.01 34.45,8.9
  Bottom 0.254: IC5.17 24.92,17.4 25.81,18.3 v30.76,18.3
N$21
  Bottom 0.254: IC6.12 28.73,37.35 28.73,32.9 27.46,31.89
  Bottom 0.305: IC6.12 25.17,37.35 | C33.1 18.46,22 18.44,21.98 19.71,23.38 19.71,25.92 18.32,27.31 18.32,30.36 19.84,31.89 27.46,31.89
N$22
  Bottom 0.305: 13.24,12.46 13.35,12.34 IC9.6 | 13.24,12.46 13.11,12.33 11.97,12.33 11.71,12.07 11.71,6.87 10.95,6.99 | 10.95,6.99 11.59,7.38 | 11.73,6.47 11.08,6.36 | R16.2 11.73,6.47 | 10.95,6.99 11.33,6.87 11.73,6.47 | 13.24,12.46 14.76,12.46 15.4,13.09 15.4,16.27 R15.1 | R15.1
N$23
  Top 0.406: 47.64,26.19 L10.1 47.52,25.93 49.23,24.22 IC11.4
N$24
  Bottom 0.305: IC6.4 17.3,38.62 17.05,38.36 17.05,32.52 15.01,30.49 15.01,30.24 15.13,30.12 C34.1
N$25  (via drill 0.5)
  Top 0.406: R34.2 57.17,16.89 v57.56,17.28
  Bottom 0.406: 57.55,17.54 57.55,17.3 | 57.55,17.54 C79.1 | 57.55,17.54 57.56,17.54 v57.56,17.28
N$26
  Top 1.016: R27.1 70.89,22.74 72.3,22.74 C46.2 72.3,20.33 | 72.3,20.33 72.47,20.33 C44.2 72.47,18.17 72.43,18.17 | 72.3,20.33 72.42,20.46 | C45.2 72.34,18.17 72.43,18.17 | L7.1 72.43,18.17
N$27
  Top 0.406: 60.6,27.46 IC10.8 60.98,27.58 64.69,27.58 65.43,28.33 R28.2
N$28
  Bottom 0.254: 15.64,27.07 16.54,26.12 16.54,23.83 15.65,22.87
  Bottom 0.305: 13.22,9.17 13.24,9.15 | R18.2 13.22,9.17 | 13.22,9.17 13.11,9.28 13.11,10.76 IC9.5 14.51,11.19 16.03,12.71 16.03,18.04 15.65,18.42 15.65,22.87 | 15.64,27.07 C34.2
N$29
  Top 0.406: C51.1 C50.1 | C51.1 45.48,23.14 | L10.2 | C51.1 47.52,23.14 L10.2 | L10.2 47.26,22.89 VCO1.P$14
N$30  (via drill 0.5)
  Top 0.61: VCO2.P$14 47.53,44.59 | VCO2.P$14 | VCO2.P$14 v47.53,45.22
  Bottom 0.61: C52.1 49.3,47.25 47.25,47.25 C53.1 | C53.1 47.53,46.24 v47.53,45.22 | L9.1 44.58,47 46.77,47 C53.1
N$31
  Bottom 0.305: R90.2 8.38,15.12 8.41,15.12 8.41,12.81 C36.1
N$32
  Top 1.016: R28.1 70.63,29.49 71.9,29.73 71.92,29.73 C49.2 71.92,29.47 | L8.1 71.75,33.41 71.83,33.41 C47.2 71.71,31.76 | 71.71,31.76 71.96,31.76 C48.2 71.83,29.73 71.92,29.47 | 71.71,31.76 71.78,31.76 | 71.92,29.47 71.91,29.47
N$33
  Bottom 0.61: 42.41,49.41 42.32,49.41 | IC12.4 42.41,49.41 | L9.2 43.69,49.41 42.41,49.41
N$34
  Bottom 0.254: IC5.15 26.19,12.46 26.19,10.3 26.06,9.92 26.06,4.58 29.87,4.58 31.02,5.72
  Bottom 0.305: 31.02,5.72 32.03,6.74 34.32,6.74 35.59,8.01 35.72,8.01 JP2.4
N$35
  Bottom 0.305: IC16.8 58.24,26.77 58.57,26.44 62.38,26.44 64.52,28.58 64.54,28.58 | 64.65,28.58 64.67,28.58 | 64.65,28.58 X1.X2 64.54,28.54 64.54,28.58 | 64.54,28.58 64.65,28.58 | C82.1 64.54,30.28 64.54,28.58
N$35R
  Top 0.406: C43.2 74.48,37.98 74.3,37.93 | 74.07,37.86 74.3,37.93 | 72.04,37.86 71.28,37.47 | 71.28,37.47 C60.1 | 74.3,37.93 74.3,37.88 74.32,37.86 74.52,38.05 C43'.2 | Q2.3 69.47,37.5 69.37,37.47 70.13,37.86 | 71.28,37.47 71.4,37.47 71.53,37.6 71.66,37.73 | 72.67,37.86 72.55,37.86 72.38,37.69 L8.2
  Top 1.27: 71.53,37.6 72,37.73 L8.2
  Top 2.184: 70.13,37.86 72.04,37.86 | 72.67,37.86 74.07,37.86
N$37
  Bottom 0.305: C80.1 56.28,19.96 56.29,19.97 IC16.16
N$39
  Bottom 0.305: IC15.4 45.07,28.22 46.63,28.22 46.5,28.35 C27.1 46.5,28.47
N$40  (via drill 0.5)
  Top 0.305: R42.1 59.29,31.43 58.95,31.77 56.57,31.77 56.57,31.99 56.53,32.03 56.57,32.07 v56.57,32.12 | v56.57,32.12 56.53,32.08 | 56.62,32.12 56.66,32.16 | v56.57,32.12 56.62,32.12 | R40.1 56.24,31.74 56.62,32.12
  Bottom 0.305: R20.1 49.8,23.94 49.8,26.44 50.06,26.69 51.45,26.69 | IC16.6 56.94,26.59 56.79,26.44 55.77,26.44 55.71,26.5 | 55.71,26.5 55.64,26.44 52.09,26.44 52.22,26.57 | IC16.4 55.64,26.57 55.71,26.5 | 51.45,26.69 52.22,26.69 | 51.45,26.69 51.45,28.6 50.82,29.23 50.82,33.3 51.71,34.19 57.17,34.19 57.68,33.68 57.68,32.79 57.51,32.62 R21.2 57.26,32.62 56.66,32.03 v56.57,32.12
  Bottom 0.406: 47.43,23.9 47.52,23.9 | R29.2 45.83,23.9 47.43,23.9 | 47.43,23.9 C76.1 | 47.43,23.9 48.79,23.9 C77.1 48.83,23.9 50.86,23.9 | 50.86,23.9 50.95,23.9 | 50.86,23.9 R20.1 | 52.3,26.61 R22.2 | 52.22,26.69 52.3,26.61 | 52.3,26.61 52.25,26.61 52.22,26.57
N$41
  Top 0.406: R23.2 53.89,14.12 54,14.11 | 51.7,14.12 51.59,14.23 | VCO1.P$10 51.7,14.12 | 53.24,14.11 51.97,14.11 51.7,14.12
  Top 2.184: 53.24,14.11 54,14.11
N$42
  Top 0.406: R24.1 60.43,14.16 61.12,14.11 | C40.2 61.51,14.38 61.12,14.11 | 60.48,14.11 60.61,13.34 61.12,14.11
  Top 2.184: 61.12,14.11 60.48,14.11
N$43
  Top 0.406: 72.31,14.23 72.42,14.23 | L7.2 72.31,14.23 | 72.31,14.23 72.31,14.74 72.16,14.74 72.16,14.36 72.31,14.36 72.31,14.23 | 72.31,14.23 71.42,14.11 | C42.2 76.38,14.23 76.1,14.23 76.1,13.6 75.98,13.6 C42'.2 75.98,13.47 | 75.98,13.47 75.72,13.22 | C63.1 73.56,13.98 75.09,14.11 | 74.96,14.11 74.96,14.23 75.98,14.23 75.98,13.47
  Top 0.61: L7.2 72.43,14.38 71.86,14.41 Q3.3
  Top 2.184: 71.42,14.11 74.96,14.11 75.09,14.11
N$45
  Bottom 0.254: 18.82,44.33 31.52,44.33 31.52,31.76 27.08,27.31
  Bottom 0.305: R12.2 18.46,44.35 18.82,44.33 | IC5.27 27.08,24.53 27.08,27.31
N$46
  Bottom 0.305: C78.2 55.14,30.63 55.01,30.76 54.99,30.74 IC16.3
N$47
  Top 0.305: R25.2 53.75,37.73
  Top 2.184: VCO2.P$10 53.75,37.73
N$49
  Top 0.406: 60.56,38.49 60.48,37.73 R26.1 | C41.2 61.78,37.73 60.86,37.73
  Top 2.184: 60.48,37.73 60.86,37.73
N$52
  Bottom 0.305: IC16.15 56.94,20.88 57.55,20.27 C79.2
N$57  (via drill 3.2 pad 5.84)
  Bottom 0.508: 1.16,39.27 1.19,39.27 9.93,48.02 9.93,49.92 JP1.1
  Bottom 0.61: 1.19,39.27 1.04,39.13 1.04,31.51 SW1.T
  Bottom 1.27: JP1.1 9.82,49.94 8.92,49.03 v3.84,49.03
N$58
  Top 0.406: R27.2 66.21,23.39 66.58,23.5 66.31,23.65 IC10.5
N$60
  Top 0.305: 1.54,13.1 R5.1 1.47,13.13 | 1.47,13.13 1.43,13.09 | LED2.C 1.54,13.21 1.47,13.13
N$664  (via drill 0.5)
  Top 0.254: 51.13,25.74 51.13,27.26 50.19,28.2 47.4,28.2 46.51,29.09 37.87,29.09 v37.87,23.76
  Top 0.305: 51.13,25.74 IC11.1 | IC10.4 53.23,23.65 51.13,25.74 | 51.13,25.74 51.84,25.03
  Bottom 0.254: v37.87,23.76 37.87,23.38 34.45,19.95 34.45,18.3 33.43,17.41 32.67,17.41 32.66,17.4 IC5.8
N$666
  Bottom 0.305: IC16.7 57.59,26.27 58.69,25.17 60.34,25.17 62,23.5 62,22.74 61.88,22.62 61.97,22.52 X1.X1 61.97,21.25 62.64,20.58 62.64,20.08 62.65,20.07 C81.1
N$10077
  Bottom 0.305: IC16.1 53.67,28.22 52.3,28.22 | C75.1 52,31.18 51.96,31.14 C74.1 52,29.83 52.34,29.49 52.34,28.47 52.47,28.35 R22.1
  Bottom 0.406: 52.3,28.22 52.22,28.22 52.3,28.31 R22.1
PLL_CLK
  Bottom 0.305: IC16.19 54.34,23.43 54.12,23.65 53.23,23.65 52.85,23.27 52.85,22.25 52.34,21.74 50.84,21.74 49.81,20.71 37.23,20.73 36.22,19.69 36.22,16.65 34.95,15.38 31.02,15.38 31.02,15.89 IC5.9
PLL_DATA
  Bottom 0.305: IC16.20 53.69,22.07 52.72,21.11 51.1,21.11 50.07,20.08 37.48,20.09 36.86,19.34 36.86,15.88 35.33,14.49 30.64,14.49 30.25,14.91 IC5.10
PLL_LE
  Bottom 0.305: 55.01,22 54.99,22.02 | 55.01,22 55.01,21.23 54.25,20.47 51.48,20.47 51.46,20.46 50.44,19.33 37.74,19.33 37.49,18.96 37.49,15.38 35.59,13.73 30.64,13.73 30,13.09 28.98,13.09 28.6,13.47 28.6,15.88 IC5.12 | 55.01,22 55.01,22.12 54.99,22.14 IC16.18
RESET  (via drill 0.5)
  Top 0.254: 37.87,21.73 37.87,6.74 34.45,6.74
  Top 0.305: v33.18,28.71 33.43,28.46 34.95,28.46 34.95,25.28 37.87,22.36 37.87,21.73 | 33.18,5.45 33.18,5.34 | JP2.5 33.18,5.45 | 34.45,6.74 33.18,5.47 33.18,5.45
  Bottom 0.305: IC5.29 28.64,27.1 30.25,28.71 v33.18,28.71
RF_OUT
  Top 0.305: U$8.COND 81.04,37.74
  Top 1.27: U$8.COND 81.68,37.73 C43.1
RF_OUT1
  Top 0.406: 80.03,14.11 80.04,14.11 | 80.03,14.11 U$9.COND | C42.1 78.08,14.11 80.03,14.11
RX
  Bottom 0.305: JP1.2 12.59,49.94 12.59,48.16 12.6,47.77 13.62,46.75 30.64,46.75 34.57,42.81 34.57,27.7 31.02,27.7 29.44,26.12 IC5.30
SDI
  Bottom 0.254: 25.44,27.46 30.25,32.27 30.25,42.55 25.56,42.55
  Bottom 0.305: IC5.25 25.44,27.46 | IC6.8 25.43,42.43 25.56,42.55
SENSE
  Top 0.406: IC2.3 19.74,8.87 20.48,8.14 | R4.2 20.44,10.38 20.35,10.29 C20.2 20.35,8.65 20.35,8.26 20.48,8.14 | 20.48,8.14 20.47,8.13 R3.1
STRIPLINE1  (via drill 3.2 pad 5.84)
  Top 0.406: C42'.1 75.22,10.93 75.21,10.93
  Top 2.184: v78.76,4.47 v78.75,4.47 75.68,7.54 75.21,8.67 75.21,10.93
STRIPLINE2  (via drill 3.2 pad 5.84)
  Top 0.406: C43'.1 74.52,40.78 74.58,40.78
  Top 1.016: 76.09,44.42 76.39,45.17 v78.76,47.65
  Top 2.184: v78.76,47.65 78.76,47.5 75.03,43.76 74.58,42.68 74.58,40.78
TX
  Bottom 0.305: IC5.31 30.24,25.65 31.52,27.06 35.21,27.06 35.21,43.06 30.89,47.63 15.01,47.63 15,49.8 JP1.3 14.99,49.92 14.89,49.92
VCC  (via drill 0.5, 0.6)
  Top 0.254: JP2.2 35.73,17.02 35.84,17.15 36.22,17.66
  Top 0.305: 9.67,38.89 9.8,38.76 9.8,39.77 v9.68,39.89 | C5.+ 10.06,39.13 | C5.+ | 13.11,39.25 12.98,39.13 C5.+ | 13.11,39.25 13.24,39.38 | 12.98,39.38 | 13.11,39.25 12.98,39.38 | C6.1 13.24,39.38 12.98,39.38 | 36.22,17.66 36.23,22.48 v35.84,22.87 | 16.67,18.04 18.7,15.88 23.4,15.88 v23.4,15.63
  Top 0.406: IC1.5 6.71,39.65 8.03,39.65 8.03,36.46 | 9.67,38.12 9.67,37.87 | 9.67,38.12 9.8,38.12 9.8,37.73 9.87,37.66 | 9.87,37.66 9.91,37.62 | 9.67,38.12 9.8,38.25 9.8,38.76 9.8,39.01 C5.+ | C7.1 4.61,36.33 8.03,36.33 | 8.03,36.46 8.03,36.33 | v14.13,31.76 8.79,31.76 8.54,32.01 | 9.87,37.66 9.81,37.6 9.3,37.6 8.03,36.33 | 8.54,32.01 8.03,32.52 8.03,36.46 | 16.67,18.04 16.67,19.82 15.52,20.84 9.68,20.84 7.65,22.87 v7.65,25.92 | v8.54,31.76 8.54,32.01
  Bottom 0.254: 24.83,18.2 25.43,18.81 27.71,18.81 29.24,20.33 30.25,20.33 31.52,19.06 32.54,19.06 IC5.6 | 21.87,18.42 22,18.3 22,16.65 22.89,15.76 v23.4,15.63
  Bottom 0.305: 39.52,26.06 39.52,28.73 39.64,28.85 42.06,28.85 42.56,28.35 42.44,28.22 42.44,28.25 IC15.3 | C31.1 38.08,25.97 37.99,26.06 | 25.17,38.62 IC6.11 25.43,38.62 25.28,38.77 IC6.10 | IC6.10 22.89,39.89 21.62,41.16 19.59,41.16 | 19.33,41.16 IC6.6 19.59,41.16 | IC7.8 15.06,34.76 | 19.59,41.16 18.06,41.16 16.54,42.68 | IC7.4 9.44,38.63 9.43,38.62 9.68,38.87 v9.68,39.89 | 14.39,33.01 14.38,33.03 | 14.39,33.01 R10.2 | v14.13,31.76 14.76,32.65 14.39,33.01 | 25.17,40.01 25.28,39.91 IC6.10 | 16.28,42.94 16.41,43.06 | 23.9,18.17 IC5.18 | IC5.18 23.92,18.17 | 24.03,18.2 24.03,18.3 | 24.03,18.2 IC5.18 | 24.03,18.2 24.03,18.17 | 36.4,23.83 34.57,22.01 33.81,21.98 33.81,20.58 | 36.4,23.83 36.48,23.89 37.74,25.15 37.74,26.06 | IC5.4 32.54,20.58 33.81,20.58 | IC5.6 33.81,19 33.81,20.58 | 24.83,18.2 24.03,18.2 | 36.27,22.82 36.1,22.87 | 36.4,23.83 36.27,22.82 | 36.27,22.82 v35.84,22.87 | 25.43,18.81 25.43,19.19 24.81,19.8 IC5.20 21.73,19.8 21.11,19.19 21.1,19.19 C25.1 21.01,18.68 21.62,18.68 21.87,18.42
  Bottom 0.406: IC15.1 42.09,26.06 39.52,26.06 37.99,26.06 37.74,26.06 | R10.2 14.54,32.78 14.51,32.78 14.51,34.26 IC7.8 15.06,34.81 | C21.1 7.26,37.35 7.14,37.86 7.39,37.74 8.92,38.62 9.43,38.62 9.85,38.62 IC7.4 9.88,38.62 12.6,38.62 12.6,42.94 16.28,42.94 18.06,41.16 | v7.65,25.92 7.01,26.55 7.01,31.12 7.65,31.76 v8.54,31.76
VCC1
  Bottom 0.305: 58.82,31.27 58.82,30.04 C73.1 58.82,30 | 58.82,31.27 58.82,31.39 C72.1 58.86,31.31 58.82,31.27 | R21.1 58.6,30.92 58.6,31.05 58.82,31.27 | 58.82,30 58.69,30.12 | IC16.9 58.89,29.93 58.82,30
VCC2
  Bottom 0.305: 54.59,19.16 C71.1 54.63,19.46 | 54.59,19.16 C70.1 | R20.2 50.86,25.68 51.2,25.68 52.6,24.28 55.14,24.28 55.64,23.77 IC16.17 55.64,20.98 54.76,20.09 54.76,19.33 54.63,19.46 | 54.59,19.16 54.59,19.42 54.63,19.46
VCO1_DCADJ
  Bottom 0.305: C23.1 16.17,6.6 16.05,7.23 R18.1 | 14.27,6.63 R8.1 | 14.27,6.63 C23.1 | 14.27,6.63 14.25,6.61 | L6.2 23.79,5.87 23.02,5.09 16.41,5.09 15.9,5.6 15.9,6.36 16.05,6.5 C23.1
VCO1_OUT
  Top 0.406: R23.1 57.04,13.99 56.8,14.11 | R24.2 58.31,14.12 58.32,14.11 57.56,14.11 | R34.1 57.17,14.5 57.56,14.11 | R31.1 57.18,13.47 57.05,13.6 57.56,14.11
  Top 2.184: 57.56,14.11 56.8,14.11
VCO1_TUNE  (via drill 0.5, 0.6)
  Top 0.305: v9.68,4.58 11.46,4.58 11.46,1.15 30.51,1.15 30.89,1.66 v30.89,8.01
  Top 0.406: 39.64,15.65 VCO1.P$2 39.39,15.52 v39.39,14.88 39.26,15.01
  Bottom 0.254: D5.C 38.88,14.63 v39.39,14.88
  Bottom 0.305: R15.2 11.83,16.89 11.71,16.77 11.67,14.53 12.47,13.73 13.36,13.73 13.42,13.67 IC9.7 12.36,13.61 10.95,12.2 10.95,8.77 9.93,7.76 9.93,4.58 v9.68,4.58 | v30.89,8.01 30.89,12.58
  Bottom 0.406: v39.39,14.88 39.64,15.14 | 38.88,14.63 38.51,15 38.13,15 35.72,12.58 30.89,12.58
VCO2_DCADJ
  Bottom 0.305: C22.1 20.34,6.6 20.39,6.65 R9.1 22.17,6.65 22.13,6.61 21.37,7.37 R17.1 21.5,9.14 21.74,8.91 L5.2
VCO2_OUT
  Top 0.305: R25.1 56.8,37.73 | 57.81,37.98 57.18,37.73 | R32.1 57.43,37.98 57.43,37.73 57.3,37.73 R33.1
  Top 0.406: 57.81,37.98 57.81,37.86 58.22,37.86 R26.2
  Top 2.184: 56.8,37.73 57.18,37.73 57.43,37.73
VCO2_TUNE  (via drill 0.6)
  Top 0.305: 39.64,39.14 39.65,39.13 | 39.64,39.14 v39.64,39.27 | 39.64,39.14 39.53,39.25 36.48,39.25 35.97,39.76 31.65,39.76 31.4,39.51 31.4,36.2 v27.71,36.2
  Top 0.406: VCO2.P$2 39.77,39.27 v39.64,39.27
  Bottom 0.254: 16.41,22.23 16.41,22.92 17.05,23.61 17.05,27.06 17.43,27.44
  Bottom 0.305: 18.32,14.87 18.33,14.88 IC9.1 18.59,14.88 18.57,14.87 17.77,15.67 R13.2 17.52,17.44 16.41,18.55 16.41,22.23 | v39.64,39.27 39.5,39.13 | 17.43,27.44 17.43,30.62 19.59,32.78 26.57,32.78 | 26.57,32.78 26.7,32.78 | v27.71,36.2 27.71,33.28 27.21,32.78 26.57,32.78
  Bottom 0.406: D6.C 39.98,39.27 v39.64,39.27
VIN  (via drill 0.6)
  Top 0.305: IC4.2 19.06,32.76 19.08,32.78 19.08,31.76 19.59,31.25 23.52,31.25 23.9,31.63 26.95,31.63 26.95,28.46 26.89,28.39 23.54,25.05 23.27,25.05 L2.L1 | 4.73,18.55 | C4.1 4.73,18.55 | 4.73,18.55 7.14,18.55 | 29.87,20.96 30.25,21.6 31.02,22.36
  Top 0.406: 8.78,44.22 6.62,44.35 2.43,40.16 2.43,39.9 | 8.78,44.22 C1.+ 10.56,44.22 | 2.43,39.9 2.43,38.38 2.87,37.94 | 2.87,37.94 2.43,37.94 | 2.87,37.94 IC1.3 | 2.43,39.9 2.56,39.9 2.62,39.84 IC1.1 | C2.1 7.51,44.22 8.78,44.22 | IC2.4 16.82,11.47 16.79,11.44 16.76,11.47 IC2.5 13.33,11.47 12.71,12.09 12.59,12.09 11.82,12.86 L1.L1 10.68,13.75 8.02,14.76 6.89,15.88 6.25,15.88 C3.1 6.76,16.39 6.76,18.28 | IC4.1 17.65,32.74 17.68,32.78 17.72,32.74 IC4.1 | IC4.1 IC4.2 | IC4.1 17.68,32.85 17.68,32.9 16.31,32.9 C16.1 15.52,33.69 15.52,30.74 6,30.74 | 23.27,25.05 23.78,24.9 26.56,22.12 IC3.6 | IC3.2 32.53,20.85 31.02,22.36 30.38,23 30.38,27.7 29.75,28.33 26.95,28.33 26.89,28.39 | L3.L1 26.87,32.9 26.95,32.9 26.95,31.63 | C15.1 29.37,16.52 29.37,20.33 29.87,20.96 | 6.76,18.28 6.76,18.3 7.14,18.42 7.14,18.55 | 6.76,18.28 R1.2
  Top 0.508: 6,30.74 4.73,32.01 3.08,32.01 2.31,32.9 2.31,37.38 2.44,37.5 | 4.73,18.55 5.24,19.06 5.24,21.09 3.84,22.49 2.95,22.49 SW1.P
  Top 0.61: C1.+ 10.94,43.97 | C4.1 4.73,18.55 | 2.44,37.5 2.87,37.94 | 6,30.74 6,29.35 3.58,26.93 v2.82,26.93
  Bottom 0.61: SW1.P v2.82,26.93
VPP
  Bottom 0.305: IC15.5 45.07,26.31 45.1,26.31
  Bottom 0.406: 45.21,25.79 45.1,25.89 45.1,26.31 45.1,26.41 | 45.21,25.79 R29.1 | 45.21,25.79 45.23,25.81 44.73,25.81 C26.1

## Text on the board
Bottom: www.ladyada.net | Wave Bubble | v1.0b
bPlace: Can you hear | me now? | Good.